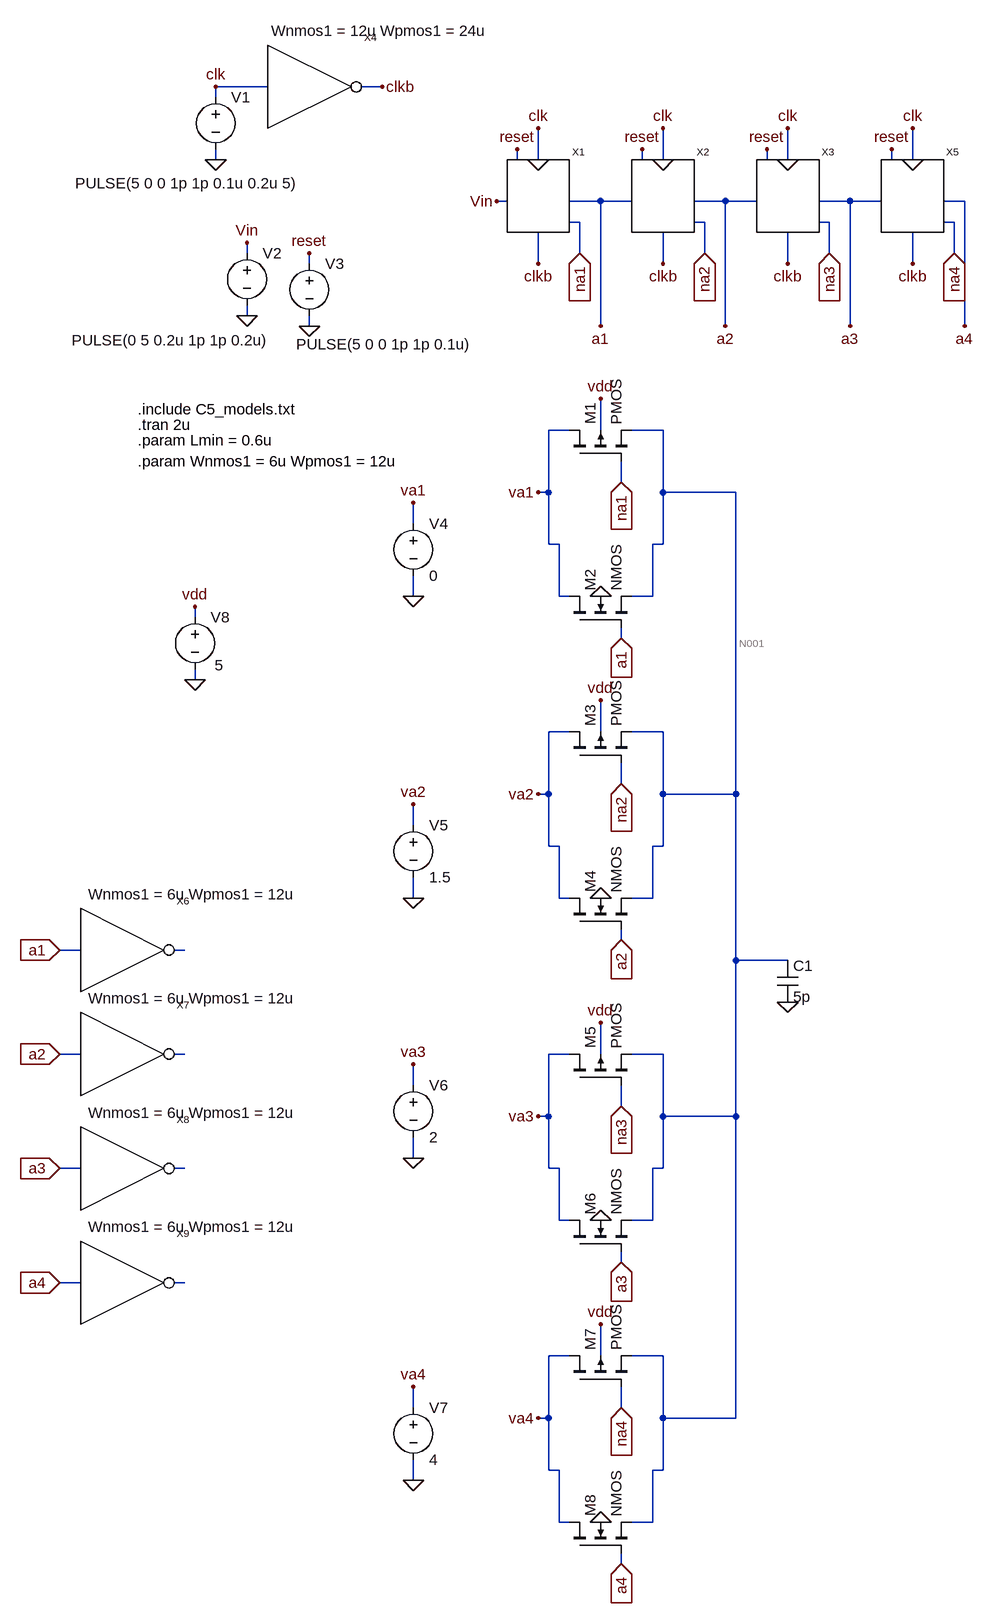
[diagram p0: schematic shift_register.asc]
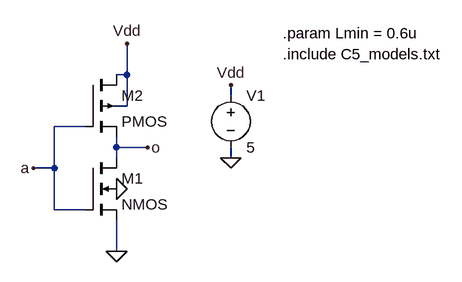
[diagram p1: sub-circuit inv.asc]
shift_register.asc, the LTspice schematic file:
Version 4
SHEET 1 988 2344
WIRE -304 -16 -384 -16
WIRE -128 -16 -160 -16
WIRE -384 0 -384 -16
WIRE -384 96 -384 80
WIRE 80 96 80 80
WIRE 112 96 112 48
WIRE 272 96 272 80
WIRE 304 96 304 48
WIRE 464 96 464 80
WIRE 496 96 496 48
WIRE 656 96 656 80
WIRE 688 96 688 48
WIRE 64 160 48 160
WIRE 208 160 160 160
WIRE 256 160 208 160
WIRE 400 160 352 160
WIRE 448 160 400 160
WIRE 592 160 544 160
WIRE 640 160 592 160
WIRE 768 160 736 160
WIRE 176 192 160 192
WIRE 368 192 352 192
WIRE 560 192 544 192
WIRE 752 192 736 192
WIRE -336 240 -336 224
WIRE 176 240 176 192
WIRE 368 240 368 192
WIRE 560 240 560 192
WIRE 752 240 752 192
WIRE -240 256 -240 240
WIRE 112 256 112 208
WIRE 304 256 304 208
WIRE 496 256 496 208
WIRE 688 256 688 208
WIRE -336 336 -336 320
WIRE -240 352 -240 336
WIRE 208 352 208 160
WIRE 400 352 400 160
WIRE 592 352 592 160
WIRE 768 352 768 160
WIRE 160 512 128 512
WIRE 208 512 208 464
WIRE 304 512 256 512
WIRE 240 592 240 560
WIRE 128 608 128 512
WIRE 128 608 112 608
WIRE 304 608 304 512
WIRE 416 608 304 608
WIRE -80 656 -80 624
WIRE 128 688 128 608
WIRE 144 688 128 688
WIRE 304 688 304 608
WIRE 304 688 288 688
WIRE -80 768 -80 736
WIRE 144 768 144 688
WIRE 160 768 144 768
WIRE 288 768 288 688
WIRE 288 768 256 768
WIRE -416 800 -416 784
WIRE 240 832 240 816
WIRE -416 896 -416 880
WIRE 160 976 128 976
WIRE 208 976 208 928
WIRE 304 976 256 976
WIRE 240 1056 240 1024
WIRE 128 1072 128 976
WIRE 128 1072 112 1072
WIRE 304 1072 304 976
WIRE 416 1072 416 608
WIRE 416 1072 304 1072
WIRE -80 1120 -80 1088
WIRE 128 1152 128 1072
WIRE 144 1152 128 1152
WIRE 304 1152 304 1072
WIRE 304 1152 288 1152
WIRE -80 1232 -80 1200
WIRE 144 1232 144 1152
WIRE 160 1232 144 1232
WIRE 288 1232 288 1152
WIRE 288 1232 256 1232
WIRE 240 1296 240 1280
WIRE -592 1312 -624 1312
WIRE -432 1312 -448 1312
WIRE 416 1328 416 1072
WIRE 496 1328 416 1328
WIRE -592 1472 -624 1472
WIRE -432 1472 -448 1472
WIRE 160 1472 128 1472
WIRE 208 1472 208 1424
WIRE 304 1472 256 1472
WIRE -80 1520 -80 1488
WIRE 240 1552 240 1520
WIRE 128 1568 128 1472
WIRE 128 1568 112 1568
WIRE 304 1568 304 1472
WIRE 416 1568 416 1328
WIRE 416 1568 304 1568
WIRE -80 1632 -80 1600
WIRE -592 1648 -624 1648
WIRE -432 1648 -448 1648
WIRE 128 1648 128 1568
WIRE 144 1648 128 1648
WIRE 304 1648 304 1568
WIRE 304 1648 288 1648
WIRE 144 1728 144 1648
WIRE 160 1728 144 1728
WIRE 288 1728 288 1648
WIRE 288 1728 256 1728
WIRE 240 1792 240 1776
WIRE -592 1824 -624 1824
WIRE -432 1824 -448 1824
WIRE 160 1936 128 1936
WIRE 208 1936 208 1888
WIRE 304 1936 256 1936
WIRE -80 2016 -80 1984
WIRE 240 2016 240 1984
WIRE 128 2032 128 1936
WIRE 128 2032 112 2032
WIRE 304 2032 304 1936
WIRE 416 2032 416 1568
WIRE 416 2032 304 2032
WIRE 128 2112 128 2032
WIRE 144 2112 128 2112
WIRE 304 2112 304 2032
WIRE 304 2112 288 2112
WIRE -80 2128 -80 2096
WIRE 144 2192 144 2112
WIRE 160 2192 144 2192
WIRE 288 2192 288 2112
WIRE 288 2192 256 2192
WIRE 240 2256 240 2240
FLAG -384 96 0
FLAG -336 336 0
FLAG -336 224 Vin
FLAG -384 -16 clk
FLAG -128 -16 clkb
FLAG -240 352 0
FLAG -240 240 reset
FLAG 112 256 clkb
FLAG 112 48 clk
FLAG 80 80 reset
FLAG 48 160 Vin
FLAG 304 256 clkb
FLAG 304 48 clk
FLAG 272 80 reset
FLAG 496 256 clkb
FLAG 496 48 clk
FLAG 464 80 reset
FLAG 688 256 clkb
FLAG 688 48 clk
FLAG 656 80 reset
FLAG 208 352 a1
FLAG 400 352 a2
FLAG 592 352 a3
FLAG 768 352 a4
FLAG 208 768 0
FLAG 240 592 na1
IOPIN 240 592 In
FLAG 240 832 a1
IOPIN 240 832 In
FLAG -624 1312 a1
IOPIN -624 1312 In
FLAG -80 768 0
FLAG -80 624 va1
FLAG 112 608 va1
FLAG 208 1232 0
FLAG 240 1056 na2
IOPIN 240 1056 In
FLAG 240 1296 a2
IOPIN 240 1296 In
FLAG -80 1232 0
FLAG -80 1088 va2
FLAG 112 1072 va2
FLAG -624 1472 a2
IOPIN -624 1472 In
FLAG 208 1728 0
FLAG 208 1424 vdd
FLAG 240 1552 na3
IOPIN 240 1552 In
FLAG 240 1792 a3
IOPIN 240 1792 In
FLAG 112 1568 va3
FLAG 208 2192 0
FLAG 208 1888 vdd
FLAG 240 2016 na4
IOPIN 240 2016 In
FLAG 240 2256 a4
IOPIN 240 2256 In
FLAG 112 2032 va4
FLAG -80 1632 0
FLAG -80 1488 va3
FLAG -80 2128 0
FLAG -80 1984 va4
FLAG -416 896 0
FLAG -416 784 vdd
FLAG 208 464 vdd
FLAG 208 928 vdd
FLAG -624 1648 a3
IOPIN -624 1648 In
FLAG -624 1824 a4
IOPIN -624 1824 In
FLAG 496 1392 0
FLAG 176 240 na1
IOPIN 176 240 In
FLAG 368 240 na2
IOPIN 368 240 In
FLAG 560 240 na3
IOPIN 560 240 In
FLAG 752 240 na4
IOPIN 752 240 In
SYMBOL voltage -384 -16 R0
WINDOW 3 -216 148 Left 2
WINDOW 123 0 0 Left 0
WINDOW 39 0 0 Left 0
SYMATTR Value PULSE(5 0 0 1p 1p 0.1u 0.2u 5)
SYMATTR InstName V1
SYMBOL voltage -336 224 R0
WINDOW 3 -270 150 Left 2
WINDOW 123 0 0 Left 0
WINDOW 39 0 0 Left 0
SYMATTR Value PULSE(0 5 0.2u 1p 1p 0.2u)
SYMATTR InstName V2
SYMBOL INV -256 -16 R0
SYMATTR InstName X4
SYMBOL voltage -240 240 R0
WINDOW 123 0 0 Left 0
WINDOW 39 0 0 Left 0
WINDOW 3 -20 140 Left 2
SYMATTR Value PULSE(5 0 0 1p 1p 0.1u)
SYMATTR InstName V3
SYMBOL shift 112 144 R0
SYMATTR InstName X1
SYMBOL shift 304 144 R0
SYMATTR InstName X2
SYMBOL shift 496 144 R0
SYMATTR InstName X3
SYMBOL shift 688 144 R0
SYMATTR InstName X5
SYMBOL pmos4 160 560 R270
SYMATTR InstName M1
SYMATTR Value2 l='Lmin' w='Wpmos1' ad='Lmin*Wpmos1' as='Lmin*Wpmos1' pd='2*(Lmin+Wpmos1)' ps='2*(Lmin+Wpmos1)' m=1
SYMBOL nmos4 160 816 R270
SYMATTR InstName M2
SYMATTR Value2 l='Lmin' w='Wnmos1' ad='Lmin*Wnmos1' as='Lmin*Wnmos1' pd='2*(Lmin+Wnmos1)' ps='2*(Lmin+Wnmos1)' m=1
SYMBOL INV -544 1312 R0
SYMATTR SpiceLine Wnmos1 = 6u Wpmos1 = 12u
SYMATTR InstName X6
SYMBOL voltage -80 640 R0
WINDOW 123 0 0 Left 0
WINDOW 39 0 0 Left 0
SYMATTR InstName V4
SYMATTR Value 0
SYMBOL pmos4 160 1024 R270
SYMATTR InstName M3
SYMATTR Value2 l='Lmin' w='Wpmos1' ad='Lmin*Wpmos1' as='Lmin*Wpmos1' pd='2*(Lmin+Wpmos1)' ps='2*(Lmin+Wpmos1)' m=1
SYMBOL nmos4 160 1280 R270
SYMATTR InstName M4
SYMATTR Value2 l='Lmin' w='Wnmos1' ad='Lmin*Wnmos1' as='Lmin*Wnmos1' pd='2*(Lmin+Wnmos1)' ps='2*(Lmin+Wnmos1)' m=1
SYMBOL voltage -80 1104 R0
WINDOW 123 0 0 Left 0
WINDOW 39 0 0 Left 0
SYMATTR InstName V5
SYMATTR Value 1.5
SYMBOL INV -544 1472 R0
SYMATTR SpiceLine Wnmos1 = 6u Wpmos1 = 12u
SYMATTR InstName X7
SYMBOL pmos4 160 1520 R270
SYMATTR InstName M5
SYMATTR Value2 l='Lmin' w='Wpmos1' ad='Lmin*Wpmos1' as='Lmin*Wpmos1' pd='2*(Lmin+Wpmos1)' ps='2*(Lmin+Wpmos1)' m=1
SYMBOL nmos4 160 1776 R270
SYMATTR InstName M6
SYMATTR Value2 l='Lmin' w='Wnmos1' ad='Lmin*Wnmos1' as='Lmin*Wnmos1' pd='2*(Lmin+Wnmos1)' ps='2*(Lmin+Wnmos1)' m=1
SYMBOL pmos4 160 1984 R270
SYMATTR InstName M7
SYMATTR Value2 l='Lmin' w='Wpmos1' ad='Lmin*Wpmos1' as='Lmin*Wpmos1' pd='2*(Lmin+Wpmos1)' ps='2*(Lmin+Wpmos1)' m=1
SYMBOL nmos4 160 2240 R270
SYMATTR InstName M8
SYMATTR Value2 l='Lmin' w='Wnmos1' ad='Lmin*Wnmos1' as='Lmin*Wnmos1' pd='2*(Lmin+Wnmos1)' ps='2*(Lmin+Wnmos1)' m=1
SYMBOL voltage -80 1504 R0
WINDOW 123 0 0 Left 0
WINDOW 39 0 0 Left 0
SYMATTR InstName V6
SYMATTR Value 2
SYMBOL voltage -80 2000 R0
WINDOW 123 0 0 Left 0
WINDOW 39 0 0 Left 0
SYMATTR InstName V7
SYMATTR Value 4
SYMBOL voltage -416 784 R0
WINDOW 3 30 90 Left 2
WINDOW 123 0 0 Left 0
WINDOW 39 0 0 Left 0
SYMATTR Value 5
SYMATTR InstName V8
SYMBOL INV -544 1648 R0
SYMATTR SpiceLine Wnmos1 = 6u Wpmos1 = 12u
SYMATTR InstName X8
SYMBOL INV -544 1824 R0
SYMATTR SpiceLine Wnmos1 = 6u Wpmos1 = 12u
SYMATTR InstName X9
SYMBOL cap 480 1328 R0
SYMATTR InstName C1
SYMATTR Value 5p
TEXT -504 504 Left 2 !.tran 2u
TEXT -504 480 Left 2 !.include C5_models.txt
TEXT -504 528 Left 2 !.param Lmin = 0.6u
TEXT -504 560 Left 2 !.param Wnmos1 = 6u Wpmos1 = 12u

inv.asc, the sub-circuit schematic file:
Version 4
SHEET 1 936 852
WIRE -240 288 -240 240
WIRE -240 288 -256 288
WIRE -80 320 -80 304
WIRE -240 336 -240 288
WIRE -240 336 -256 336
WIRE -304 368 -352 368
WIRE -256 400 -256 384
WIRE -208 400 -256 400
WIRE -256 416 -256 400
WIRE -80 416 -80 400
WIRE -352 432 -352 368
WIRE -352 432 -384 432
WIRE -352 496 -352 432
WIRE -304 496 -352 496
WIRE -256 560 -256 512
FLAG -256 464 0
FLAG -256 560 0
FLAG -240 240 Vdd
FLAG -384 432 a
FLAG -208 400 o
FLAG -80 416 0
FLAG -80 304 Vdd
SYMBOL nmos4 -304 416 R0
SYMATTR InstName M1
SYMATTR Value2 l='Lmin' w='Wnmos1' ad='Lmin*Wnmos1' as='Lmin*Wnmos1' pd='2*(Lmin+Wnmos1)' ps='2*(Lmin+Wnmos1)' m=1
SYMBOL pmos4 -304 288 R0
SYMATTR InstName M2
SYMATTR Value2 l='Lmin' w='Wpmos1' ad='Lmin*Wpmos1' as='Lmin*Wpmos1' pd='2*(Lmin+Wpmos1)' ps='2*(Lmin+Wpmos1)' m=1
SYMBOL voltage -80 304 R0
SYMATTR InstName V1
SYMATTR Value 5
TEXT 0 256 Left 2 !.include C5_models.txt
TEXT 0 224 Left 2 !.param Lmin = 0.6u

The netlist it stands for:
* shift_register.asc
V1 clk 0 PULSE(5 0 0 1p 1p 0.1u 0.2u 5)
V2 Vin 0 PULSE(0 5 0.2u 1p 1p 0.2u)
XX4 clk clkb inv params: Wnmos1 = 12u Wpmos1 = 24u
V3 reset 0 PULSE(5 0 0 1p 1p 0.1u)
XX1 Vin a1 clk clkb reset na1 shift  ; pins D Q clk clkb reset Qneg
XX2 a1 a2 clk clkb reset na2 shift  ; pins D Q clk clkb reset Qneg
XX3 a2 a3 clk clkb reset na3 shift  ; pins D Q clk clkb reset Qneg
XX5 a3 a4 clk clkb reset na4 shift  ; pins D Q clk clkb reset Qneg
M1 va1 na1 N001 vdd PMOS l='Lmin' w='Wpmos1' ad='Lmin*Wpmos1' as='Lmin*Wpmos1' pd='2*(Lmin+Wpmos1)' ps='2*(Lmin+Wpmos1)' m=1
M2 va1 a1 N001 0 NMOS l='Lmin' w='Wnmos1' ad='Lmin*Wnmos1' as='Lmin*Wnmos1' pd='2*(Lmin+Wnmos1)' ps='2*(Lmin+Wnmos1)' m=1
XX6 a1 N002 inv params: Wnmos1 = 6u Wpmos1 = 12u
V4 va1 0 0
M3 va2 na2 N001 vdd PMOS l='Lmin' w='Wpmos1' ad='Lmin*Wpmos1' as='Lmin*Wpmos1' pd='2*(Lmin+Wpmos1)' ps='2*(Lmin+Wpmos1)' m=1
M4 va2 a2 N001 0 NMOS l='Lmin' w='Wnmos1' ad='Lmin*Wnmos1' as='Lmin*Wnmos1' pd='2*(Lmin+Wnmos1)' ps='2*(Lmin+Wnmos1)' m=1
V5 va2 0 1.5
XX7 a2 N003 inv params: Wnmos1 = 6u Wpmos1 = 12u
M5 va3 na3 N001 vdd PMOS l='Lmin' w='Wpmos1' ad='Lmin*Wpmos1' as='Lmin*Wpmos1' pd='2*(Lmin+Wpmos1)' ps='2*(Lmin+Wpmos1)' m=1
M6 va3 a3 N001 0 NMOS l='Lmin' w='Wnmos1' ad='Lmin*Wnmos1' as='Lmin*Wnmos1' pd='2*(Lmin+Wnmos1)' ps='2*(Lmin+Wnmos1)' m=1
M7 va4 na4 N001 vdd PMOS l='Lmin' w='Wpmos1' ad='Lmin*Wpmos1' as='Lmin*Wpmos1' pd='2*(Lmin+Wpmos1)' ps='2*(Lmin+Wpmos1)' m=1
M8 va4 a4 N001 0 NMOS l='Lmin' w='Wnmos1' ad='Lmin*Wnmos1' as='Lmin*Wnmos1' pd='2*(Lmin+Wnmos1)' ps='2*(Lmin+Wnmos1)' m=1
V6 va3 0 2
V7 va4 0 4
V8 vdd 0 5
XX8 a3 N004 inv params: Wnmos1 = 6u Wpmos1 = 12u
XX9 a4 N005 inv params: Wnmos1 = 6u Wpmos1 = 12u
C1 N001 0 5p

* block symbol definitions
.subckt inv a o
M1 o a 0 0 NMOS l='Lmin' w='Wnmos1' ad='Lmin*Wnmos1' as='Lmin*Wnmos1' pd='2*(Lmin+Wnmos1)' ps='2*(Lmin+Wnmos1)' m=1
M2 Vdd a o Vdd PMOS l='Lmin' w='Wpmos1' ad='Lmin*Wpmos1' as='Lmin*Wpmos1' pd='2*(Lmin+Wpmos1)' ps='2*(Lmin+Wpmos1)' m=1
V1 Vdd 0 5
.include C5_models.txt
.param Lmin = 0.6u
.ends inv

.model NMOS NMOS
.model PMOS PMOS
.lib standard.mos
.tran 2u
.include C5_models.txt
.param Lmin = 0.6u
.param Wnmos1 = 6u Wpmos1 = 12u
.backanno
.end

* Results of the author's LTspice run, read from the files saved beside the schematic
* Operating Point, zero values left out:
*   V(clk) = 5 V
*   V(reset) = 5 V
*   V(na1) = 1.26 V
*   V(a1) = 4.806 V
*   V(na2) = 1.161 V
*   V(a2) = 4.851 V
*   V(na3) = 1.161 V
*   V(a3) = 4.851 V
*   V(na4) = 1.161 V
*   V(a4) = 4.851 V
*   V(n001) = 1.691 V
*   V(vdd) = 5 V
*   V(va2) = 1.5 V
*   V(va3) = 2 V
*   V(va4) = 4 V
*   Id(M8) = 1.172 mA
*   Ib(M8) = -5.692 pA
*   Is(M8) = -1.172 mA
*   Id(M6) = 391.2 µA
*   Ib(M6) = -3.692 pA
*   Is(M6) = -391.2 µA
*   Id(M4) = -265.1 µA
*   Ib(M4) = -3.192 pA
*   Is(M4) = 265.1 µA
*   Id(M2) = -2.164 mA
*   Ib(M2) = -1.692 pA
*   Is(M2) = 2.164 mA
*   Id(M7) = 865.4 µA
*   Ib(M7) = 4.31 pA
*   Is(M7) = -865.4 µA
*   Id(M5) = -2.584 pA
*   Ib(M5) = 6.31 pA
*   Is(M5) = -3.726 pA
*   Id(M3) = -3.501 pA
*   Ib(M3) = 6.81 pA
*   Is(M3) = -3.309 pA
*   Id(M1) = -5.001 pA
*   Ib(M1) = 8.31 pA
*   Is(M1) = -3.309 pA
*   I(V8) = -25.74 pA
*   I(V7) = -2.037 mA
*   I(V6) = -391.2 µA
*   I(V5) = 265.1 µA
*   I(V4) = 2.164 mA
*   I(V2) = 5.027 pA
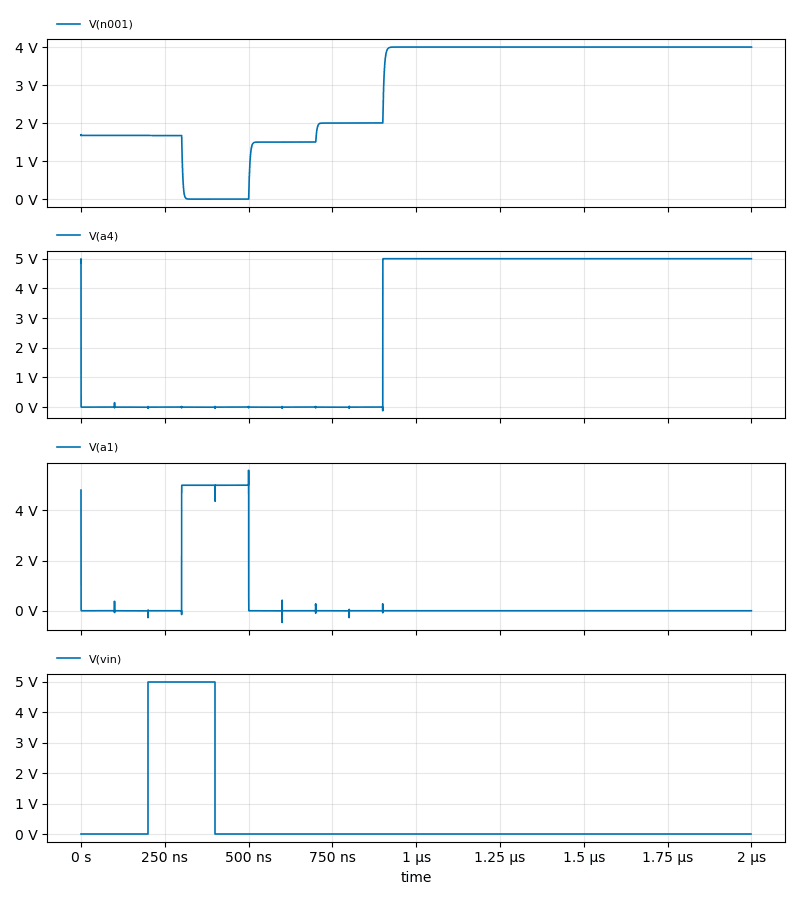
[diagram p2: Transient Analysis of shift_register.asc, plotted from the saved traces]
* Transient Analysis, 1 run:
*   V(n001): min -1.664 mV, max 4 V, average 2.796 V, rms 3.132 V, last 4 V
*   V(a4): min -124.7 mV, max 5.001 V, average 2.75 V, rms 3.708 V, last 5 V
*   V(a1): min -466.5 mV, max 5.593 V, average 500.3 mV, rms 1.581 V, last 0 V
*   V(vin): min 0 V, max 5 V, average 500 mV, rms 1.581 V, last 0 V